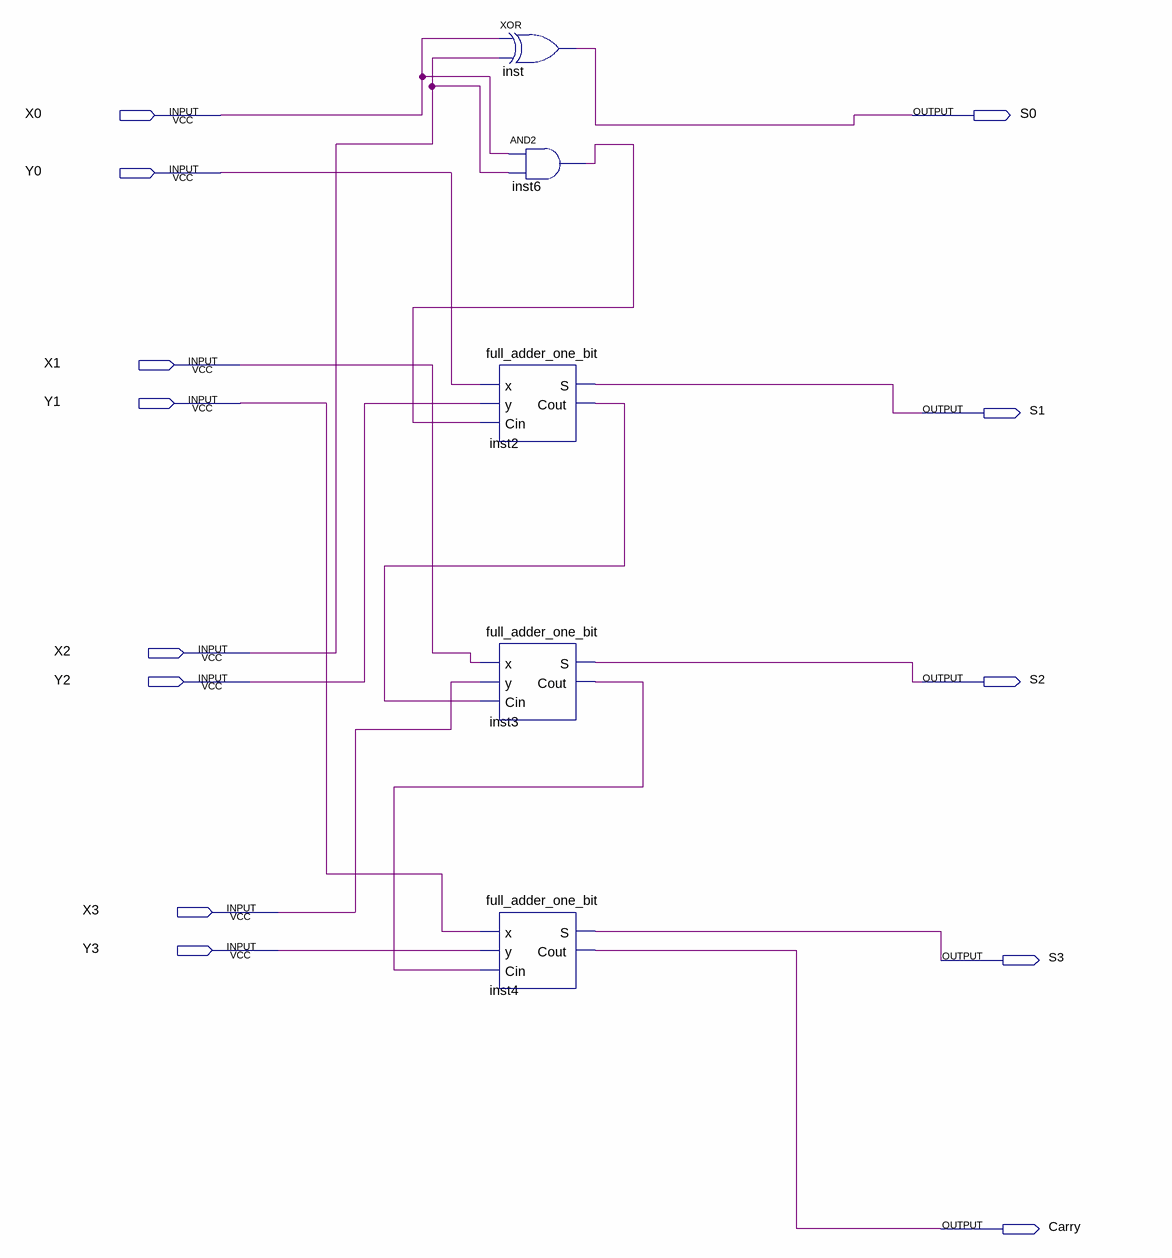
[diagram p0: schematic sheet]
// Quartus schematic full_adder_four_bit.bdf as structural Verilog: 5 symbols, 13 pins
module full_adder_four_bit (
  input  X0,
  input  Y0,
  input  X1,
  input  Y1,
  input  X2,
  input  Y2,
  input  X3,
  input  Y3,
  output S0,
  output S1,
  output S2,
  output S3,
  output Carry
);

  wire inst2_cout, inst3_cout, inst6_out;

  full_adder_one_bit inst2 (.x(Y0), .y(Y2), .Cin(inst6_out), .S(S1), .Cout(inst2_cout));
  full_adder_one_bit inst3 (.x(X1), .y(X3), .Cin(inst2_cout), .S(S2), .Cout(inst3_cout));
  full_adder_one_bit inst4 (.x(Y1), .y(Y3), .Cin(inst3_cout), .S(S3), .Cout(Carry));
  xor inst (S0, X0, X2);
  and inst6 (inst6_out, X0, X2);
endmodule
